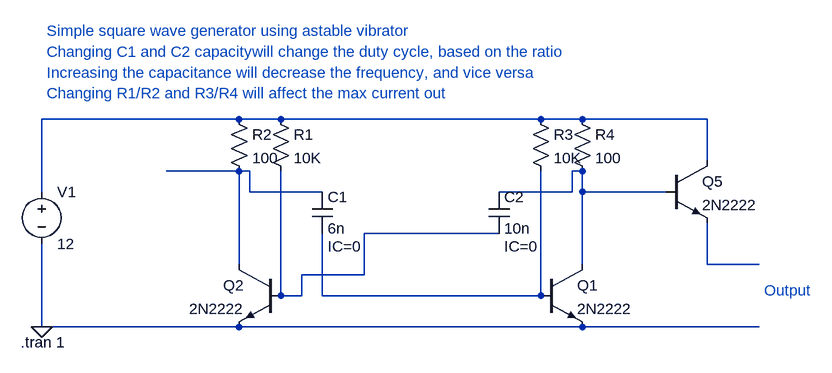
[diagram p0: schematic square_wave_generator.asc]
square_wave_generator.asc, the LTspice schematic file:
Version 4
SHEET 1 1588 680
WIRE -416 -144 -720 -144
WIRE -352 -144 -416 -144
WIRE 48 -144 -352 -144
WIRE 112 -144 48 -144
WIRE 304 -144 112 -144
WIRE 304 -80 304 -144
WIRE -416 -64 -528 -64
WIRE -400 -64 -416 -64
WIRE 112 -64 96 -64
WIRE -720 -32 -720 -144
WIRE -400 -32 -400 -64
WIRE -288 -32 -400 -32
WIRE 96 -32 96 -64
WIRE 96 -32 -16 -32
WIRE 112 -32 112 -64
WIRE 240 -32 112 -32
WIRE -16 32 -224 32
WIRE -416 80 -416 -64
WIRE 112 80 112 -32
WIRE 304 80 304 16
WIRE 384 80 304 80
WIRE -224 96 -224 32
WIRE -224 96 -320 96
WIRE -352 128 -352 -64
WIRE -352 128 -368 128
WIRE -320 128 -320 96
WIRE -320 128 -352 128
WIRE -288 128 -288 32
WIRE 48 128 48 -64
WIRE 48 128 -288 128
WIRE -720 176 -720 48
WIRE -416 176 -720 176
WIRE 112 176 -416 176
WIRE 384 176 112 176
FLAG -720 176 0
SYMBOL npn 48 80 R0
SYMATTR InstName Q1
SYMATTR Value 2N2222
SYMBOL npn -352 80 M0
SYMATTR InstName Q2
SYMATTR Value 2N2222
SYMBOL res -368 -160 R0
SYMATTR InstName R1
SYMATTR Value 10K
SYMATTR SpiceLine tol=1 pwr=500m
SYMBOL res -432 -160 R0
SYMATTR InstName R2
SYMATTR Value 100
SYMATTR SpiceLine tol=1 pwr=500m
SYMBOL res 32 -160 R0
SYMATTR InstName R3
SYMATTR Value 10K
SYMATTR SpiceLine tol=1 pwr=500m
SYMBOL res 96 -160 R0
SYMATTR InstName R4
SYMATTR Value 100
SYMATTR SpiceLine tol=1 pwr=500m
SYMBOL cap -304 -32 R0
WINDOW 39 24 84 Left 2
SYMATTR SpiceLine IC=0
SYMATTR InstName C1
SYMATTR Value 6n
SYMBOL cap -32 -32 R0
WINDOW 123 24 84 Left 2
SYMATTR Value2 IC=0
SYMATTR InstName C2
SYMATTR Value 10n
SYMBOL voltage -720 -48 R0
WINDOW 123 0 0 Left 0
WINDOW 39 0 0 Left 0
SYMATTR InstName V1
SYMATTR Value 12
SYMBOL npn 240 -80 R0
SYMATTR InstName Q5
SYMATTR Value 2N2222
TEXT -752 200 Left 2 !.tran 1
TEXT 392 120 Left 2 ;Output
TEXT -712 -248 Left 2 ;Changing C1 and C2 capacitywill change the duty cycle, based on the ratio
TEXT -712 -280 Left 2 ;Simple square wave generator using astable vibrator
TEXT -712 -184 Left 2 ;Changing R1/R2 and R3/R4 will affect the max current out
TEXT -712 -216 Left 2 ;Increasing the capacitance will decrease the frequency, and vice versa

The netlist it stands for:
* square_wave_generator.asc
Q1 N003 N006 0 0 2N2222
Q2 N002 N004 0 0 2N2222
R1 N001 N004 10K tol=1 pwr=500m
R2 N001 N002 100 tol=1 pwr=500m
R3 N001 N006 10K tol=1 pwr=500m
R4 N001 N003 100 tol=1 pwr=500m
C1 N002 N006 6n IC=0
C2 N003 N004 10n IC=0
V1 N001 0 12
Q5 N001 N003 N005 0 2N2222
.model NPN NPN
.model PNP PNP
.lib standard.bjt
.tran 1
* Output
* Changing C1 and C2 capacitywill change the duty cycle, based on the ratio
* Simple square wave generator using astable vibrator
* Changing R1/R2 and R3/R4 will affect the max current out
* Increasing the capacitance will decrease the frequency, and vice versa
.backanno
.end